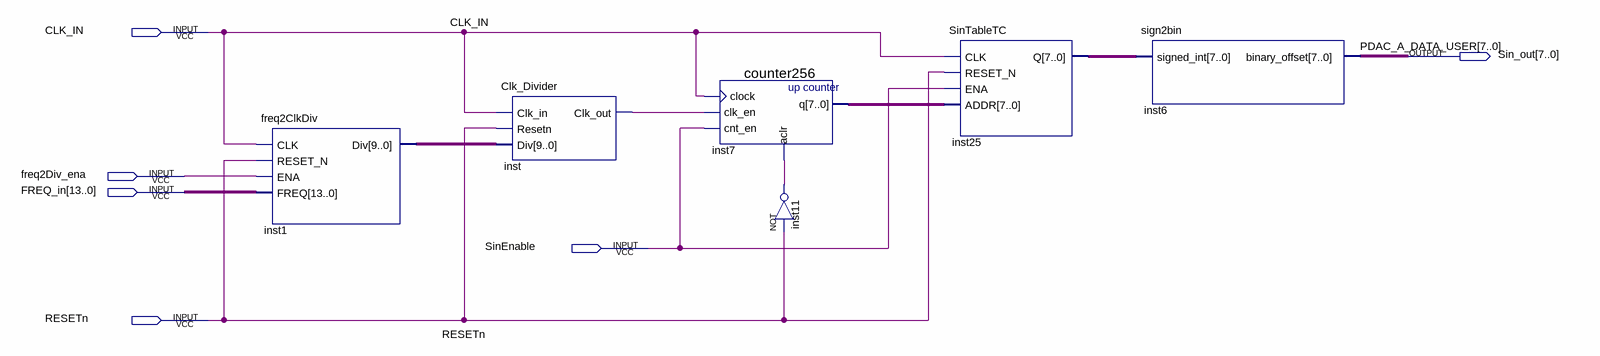
[diagram p0: schematic sheet]
// Quartus schematic FREQ2SIN.bdf as structural Verilog: 6 symbols, 6 pins
module FREQ2SIN (
  input  CLK_IN,
  input  freq2Div_ena,
  input  [13:0] FREQ_in,
  input  SinEnable,
  input  RESETn,
  output [7:0] Sin_out
);

  wire inst11_out, inst_clk_out;
  wire [7:0] inst7_q, inst25_q;
  wire [9:0] inst1_div;

  freq2ClkDiv inst1 (.CLK(CLK_IN), .RESET_N(RESETn), .ENA(freq2Div_ena), .FREQ(FREQ_in), .Div(inst1_div));
  Clk_Divider inst (.Clk_in(CLK_IN), .Resetn(RESETn), .Div(inst1_div), .Clk_out(inst_clk_out));
  counter256 inst7 (.clock(CLK_IN), .clk_en(inst_clk_out), .cnt_en(SinEnable), .aclr(inst11_out), .q(inst7_q));
  not inst11 (inst11_out, RESETn);
  SinTableTC inst25 (.CLK(CLK_IN), .RESET_N(RESETn), .ENA(SinEnable), .ADDR(inst7_q), .Q(inst25_q));
  sign2bin inst6 (.signed_int(inst25_q), .binary_offset(Sin_out));

  // Other names for the same wires on the sheet: PDAC_A_DATA_USER[7:0] = Sin_out
endmodule
